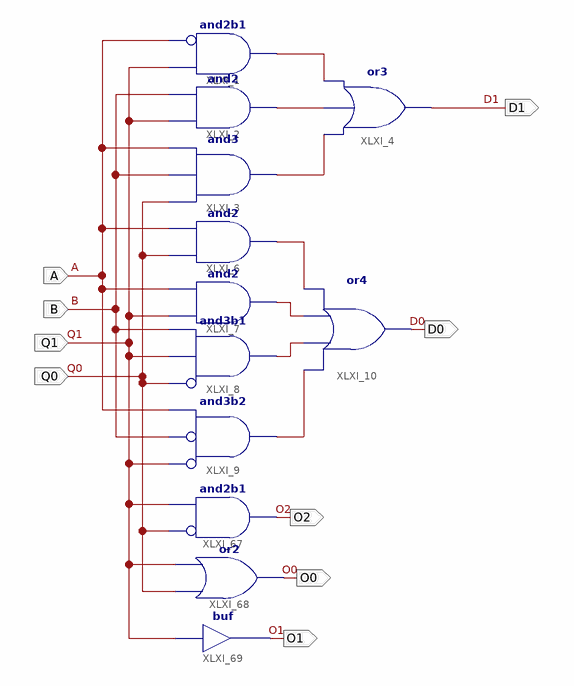
[diagram p0: schematic sheet 1]
// Xilinx ISE schematic ExamenP4ctrl_v1.sch (spartan3) as structural Verilog: 12 symbols, 9 ports
module ExamenP4ctrl_v1 (
  input  A,
  input  B,
  input  Q1,
  input  Q0,
  output D0,
  output D1,
  output O2,
  output O0,
  output O1
);

  wire XLXN_8, XLXN_9, XLXN_10, XLXN_26, XLXN_27, XLXN_28, XLXN_29;

  and XLXI_1 (XLXN_8, ~A, Q1);  // and2b1
  and XLXI_2 (XLXN_9, B, Q1);
  and XLXI_3 (XLXN_10, A, B, Q0);
  or XLXI_4 (D1, XLXN_8, XLXN_9, XLXN_10);
  and XLXI_6 (XLXN_26, A, Q0);
  and XLXI_7 (XLXN_27, A, Q1);
  and XLXI_8 (XLXN_28, ~Q0, Q1, B);  // and3b1
  and XLXI_9 (XLXN_29, ~Q1, ~B, A);  // and3b2
  or XLXI_10 (D0, XLXN_29, XLXN_28, XLXN_27, XLXN_26);
  and XLXI_67 (O2, ~Q0, Q1);  // and2b1
  or XLXI_68 (O0, Q0, Q1);
  buf XLXI_69 (O1, Q1);
endmodule
